# EAGLE design srm20metal (EAGLE 7.5.0)
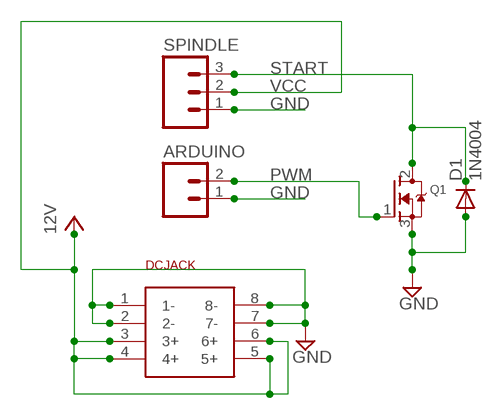
[diagram p0: schematic, sheet 1]

## Parts
ARDUINO  M02PTH  [1X02]
D1  1N4004  [DO41-10]
Q1  MOSFET-NGDS_TO220V  [TO220V]
SPINDLE  M03PTH  [1X03]
U$1  DCJACK  [DIPKIT]

## Nets
GND: ARDUINO.1 D1.A Q1.3(S) SPINDLE.1 U$1.1(1-) U$1.2(2-) U$1.7(7-) U$1.8(8-)
PWM: ARDUINO.2 Q1.1(G)
START: D1.C Q1.2(D) SPINDLE.3
VCC: SPINDLE.2 U$1.3(3+) U$1.4(4+) U$1.5(5+) U$1.6(6+) ; supply symbol labelled 12V

## Library data of the parts
ARDUINO = SparkFun:M02: Header 2 Standard 2-pin 0.1" header. Use with straight break away headers (SKU : PRT-00116), right angle break away headers (PRT-00553), swiss pins (PRT-00743), machine pins (PRT-00117), and female headers (PRT-00115). Molex polarized connector foot print use with SKU : PRT-08233 with associated crimp pins and housings.
D1 = adafruit:1N4004: DIODE General purpose 1N400x type rectifier (With bigger pads) http://www.ladyada.net/library/pcb/eaglelibrary.html
Q1 = adafruit:MOSFET-N: N-Channel Mosfet 2N7002E - 60V 260mA SOT23 [Digikey: 2N7002ET1GOSTR-ND] - REEL BSH103 - 30V 850mA SOT23 [Digikey: 568-5013-1-ND]
SPINDLE = SparkFun:M03: Header 3 Standard 3-pin 0.1" header. Use with straight break away headers (SKU : PRT-00116), right angle break away headers (PRT-00553), swiss pins (PRT-00743), machine pins (PRT-00117), and female headers (PRT-00115). Molex polarized connector foot print use with SKU : PRT-08232 with associated crimp pins and housings.
U$1 = srm20metal:DCJACK

## Board
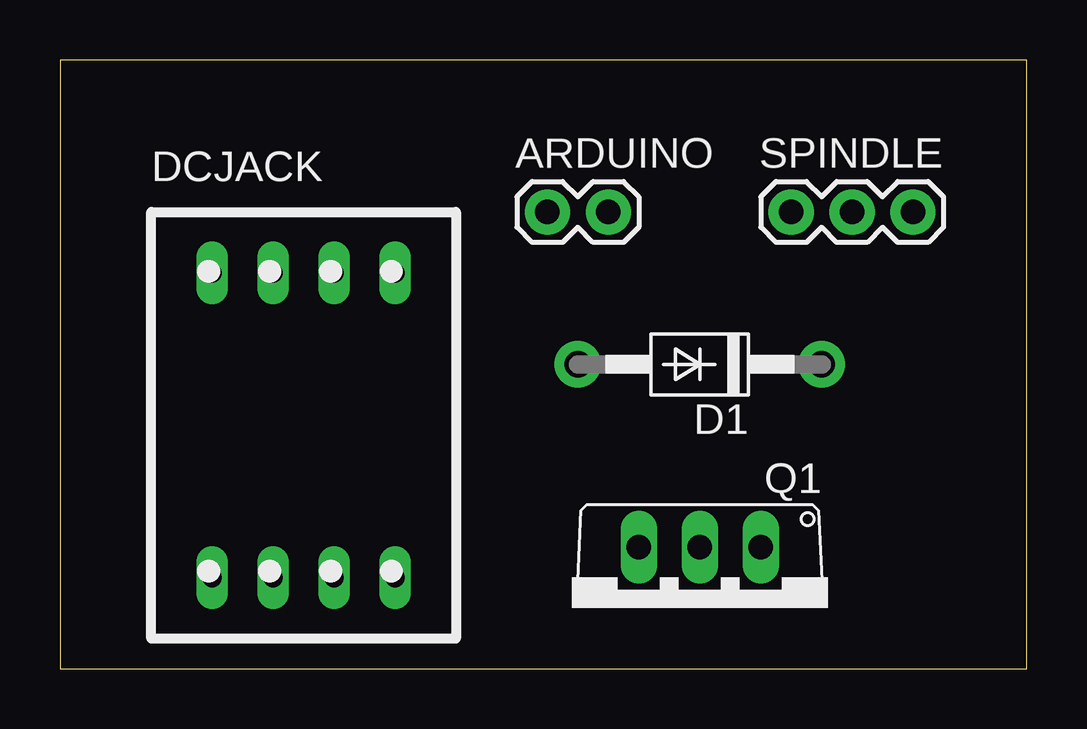
[diagram p1: board, top side]
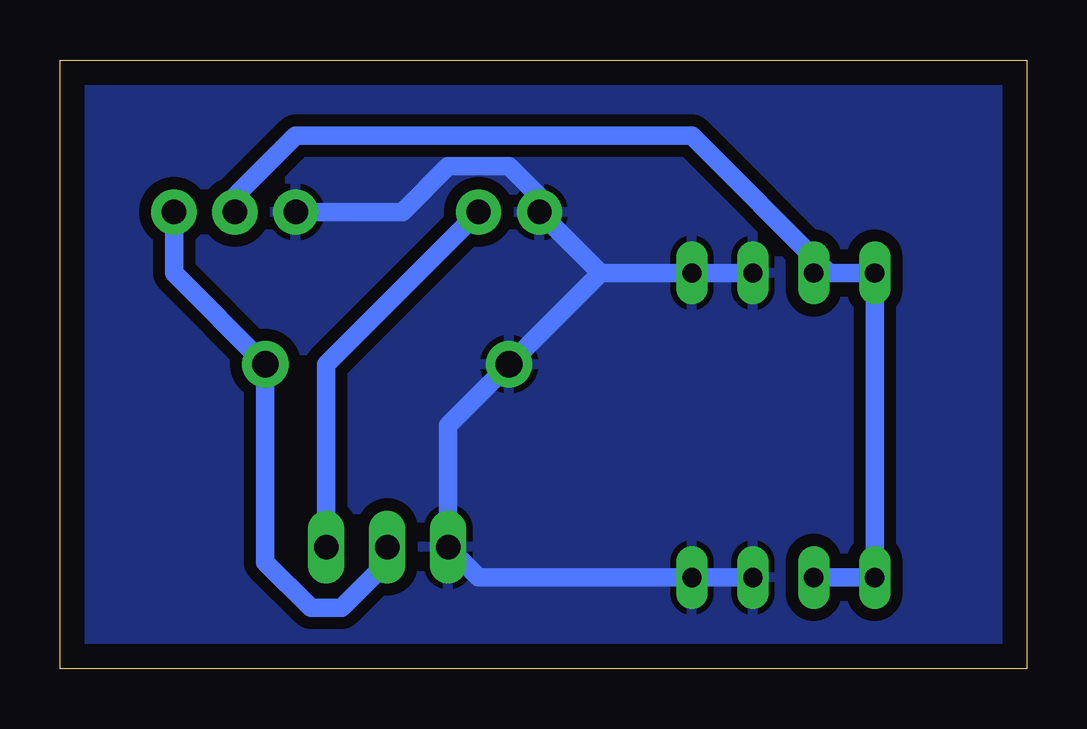
[diagram p2: board, bottom side, seen from below]

Size 40.31 x 25.39 mm. Coordinates in mm from the lower left corner, seen from the top.
Outline: 0,0 40.31,0 40.31,25.39 0,25.39 0,0
Copper layers (1*16): Top 0.035mm / dielectric 1.5mm / Bottom 0.035mm
Design rules "default *": minimum track width 30mil, minimum drill 24mil, track to track 20mil, track to pad 20mil, pad to pad 20mil, via to via 20mil, smd to smd 20mil, copper to edge 40mil, drill to drill 8mil, minimum pad ring 10mil, minimum via ring 8mil, stop-mask expansion 4mil, vias tented up to drill 0mil, thermal gap 10mil

### Footprints (pad centres in the part's own frame; a part is rotated, then mirrored left to right if it is on the bottom)
1X02 = drill 1.016 pad 1.88: 1 0,0; 2 2.54,0
DO41-10 = drill 1.118 pad 1.93: A 5.08,0; C -5.08,0
TO220V = drill 1.016 long: 1 -2.54,-2.54; 2 0,-2.54; 3 2.54,-2.54
1X03 = drill 1.016 pad 1.88: 1 0,0; 2 2.54,0; 3 5.08,0
DIPKIT = drill 0.8 long: 1 3.81,-6.35; 2 1.27,-6.35; 3 -1.27,-6.35; 4 -3.81,-6.35; 5 -3.81,6.35; 6 -1.27,6.35; 7 1.27,6.35; 8 3.81,6.35

### Placement (x,y rotation side)
ARDUINO  20.32,19.05 0 top
D1  26.67,12.7 180 top
Q1  26.67,2.54 180 top
SPINDLE  30.48,19.05 0 top
U$1  10.16,10.16 0 top

### Tracks (layer width: path | path; a pad name or v marks a point on that pad's centre or on a via)
GND
  Bottom 0.762: U$1.2 U$1.1 22.86,3.81 Q1.3 24.13,10.16 D1.A 17.78,16.51 | U$1.7 U$1.8 17.78,16.51 | 17.78,16.51 ARDUINO.1 20.32,19.68 21.59,20.95 24.13,20.95 26.04,19.05 SPINDLE.1
  pour Bottom: 0,0 40.64,0 40.64,25.4 0,25.4
PWM
  Bottom 0.762: Q1.1 29.21,12.7 ARDUINO.2
START
  Bottom 0.762: Q1.2 26.67,4.45 28.57,2.54 29.84,2.54 31.75,4.45 D1.C 35.56,16.51 SPINDLE.3
VCC
  Bottom 0.762: U$1.3 U$1.4 U$1.5 8.26,16.51 | SPINDLE.2 33.02,19.68 30.48,22.23 13.97,22.23 8.26,16.51 | 8.26,16.51 U$1.6